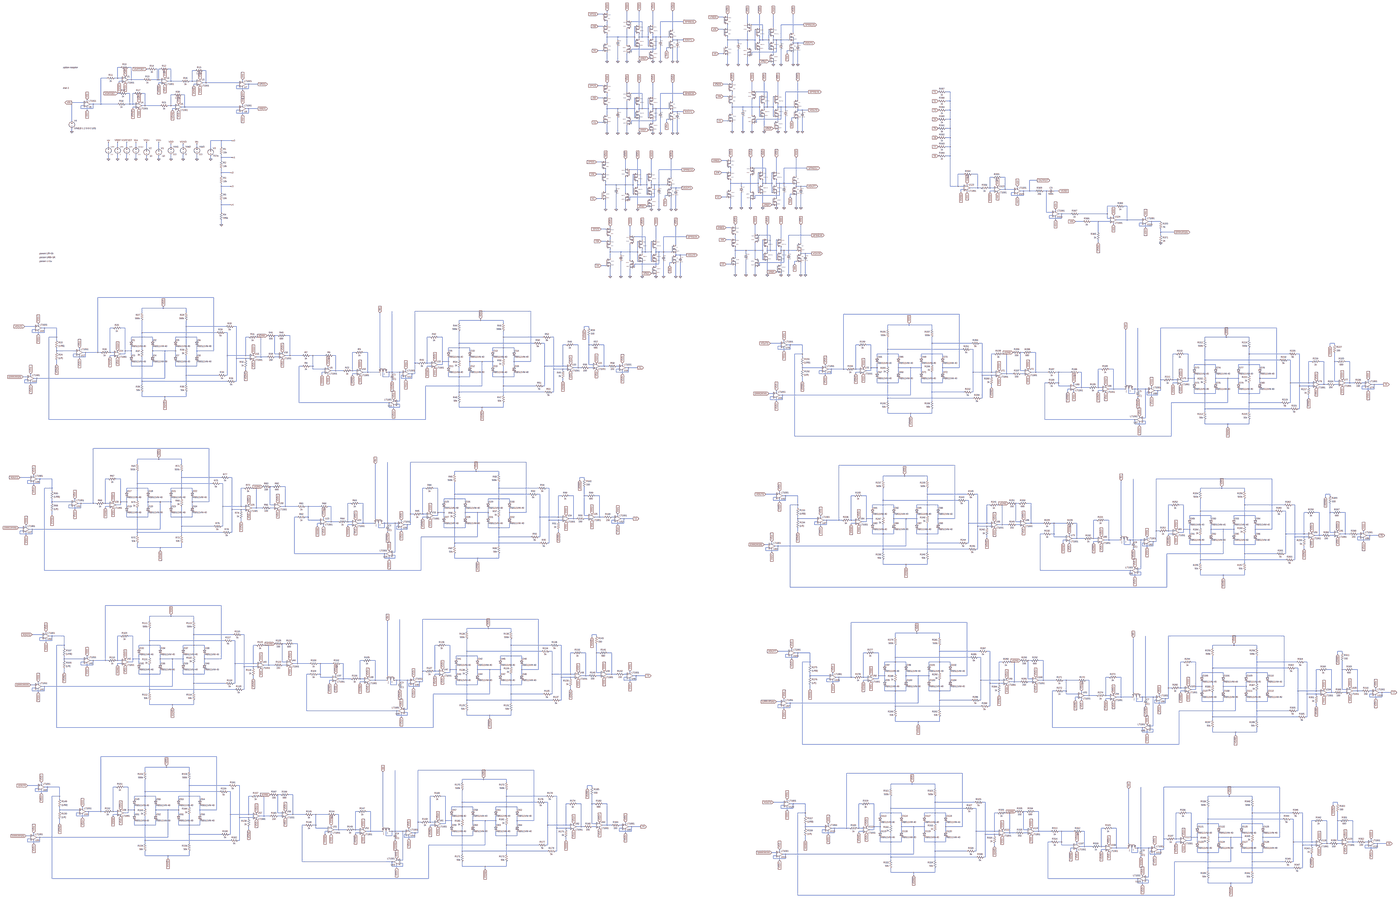
[diagram p0: schematic OZ_8_bounded_curves.asc, whole sheet]
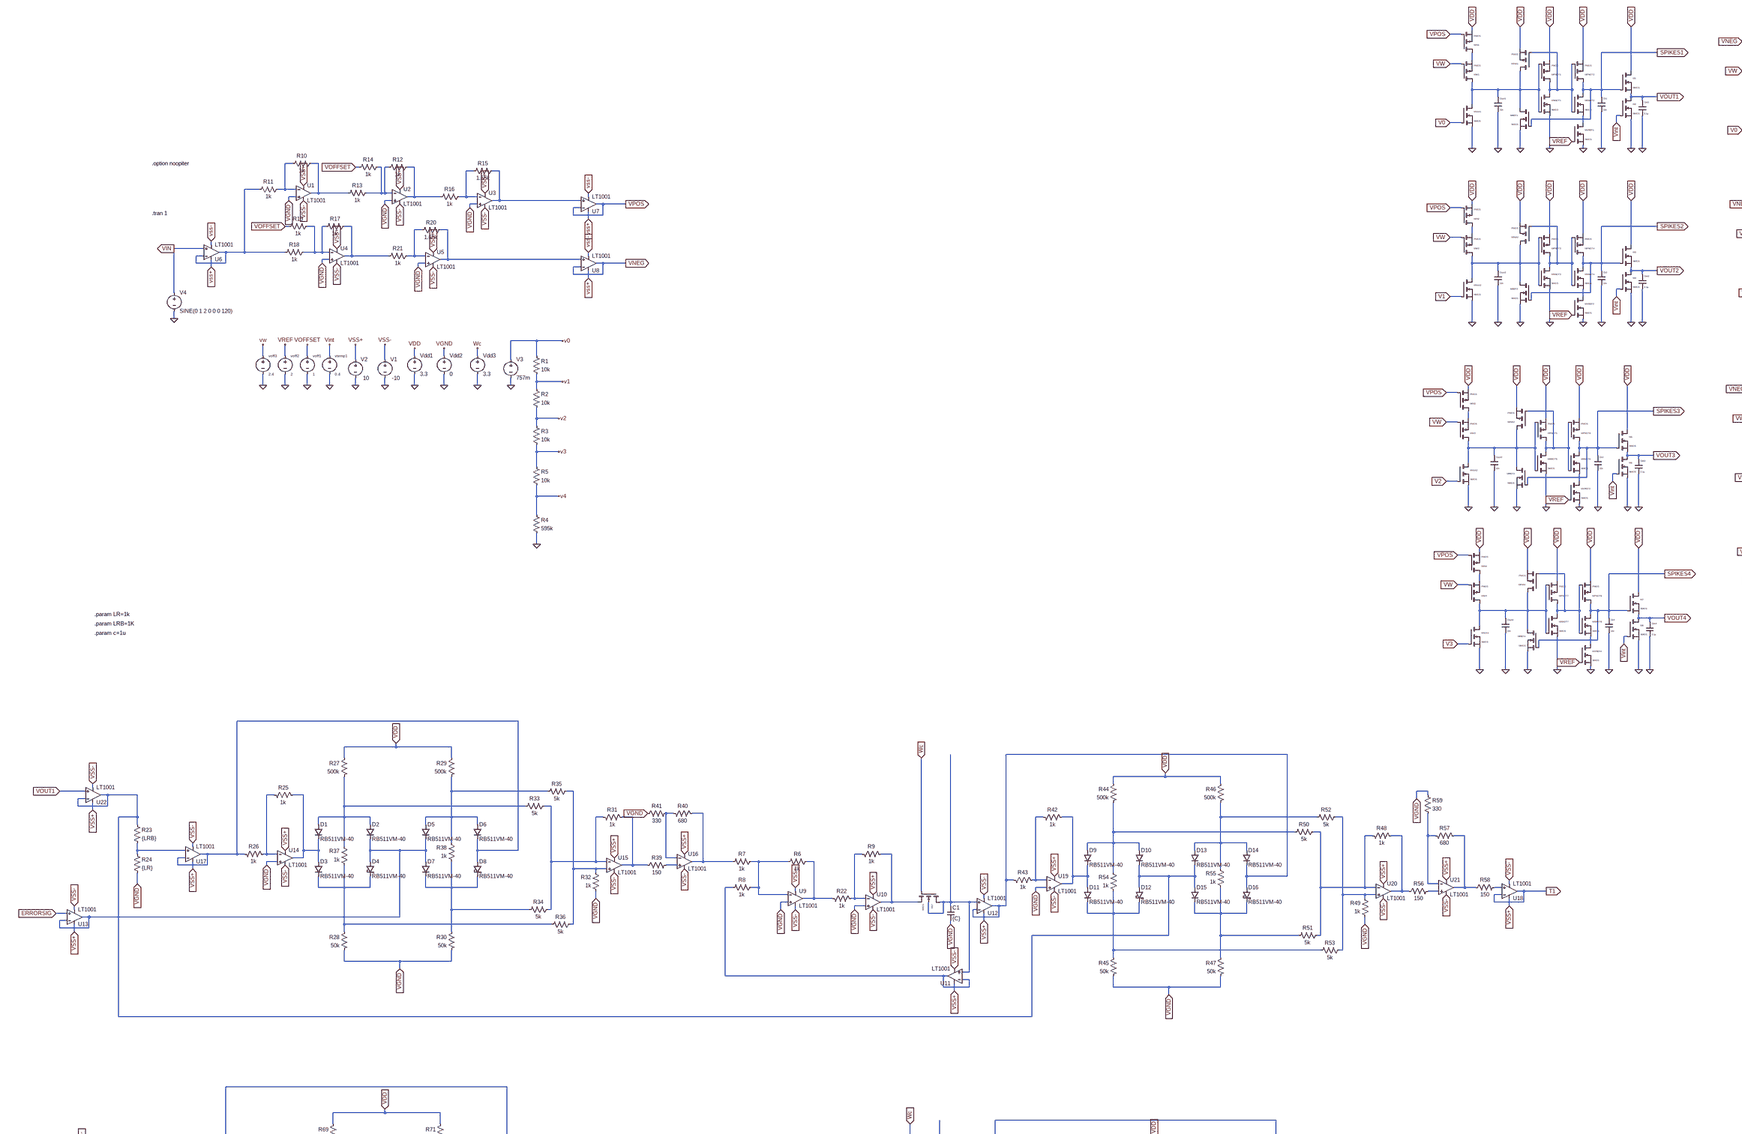
[diagram p1: schematic OZ_8_bounded_curves.asc, part, row 1 of 2, column 1 of 2]
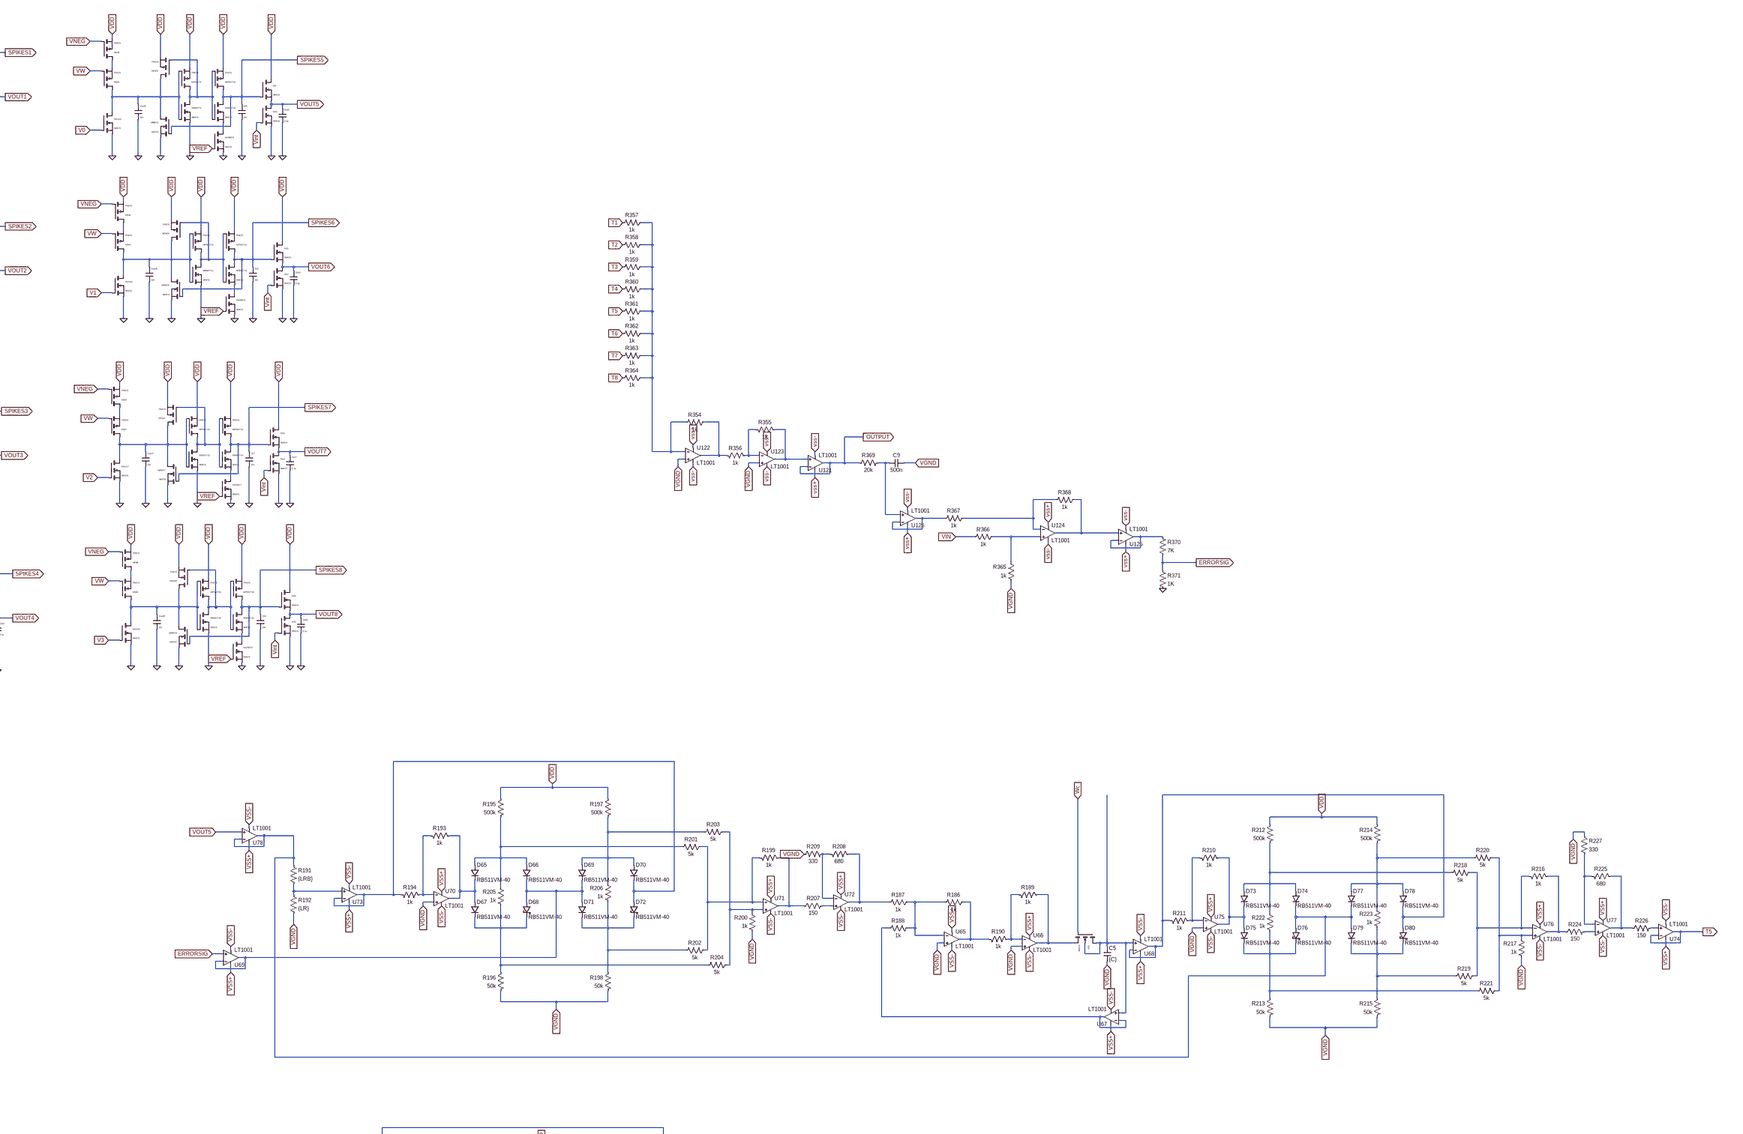
[diagram p2: schematic OZ_8_bounded_curves.asc, part, row 1 of 2, column 2 of 2]
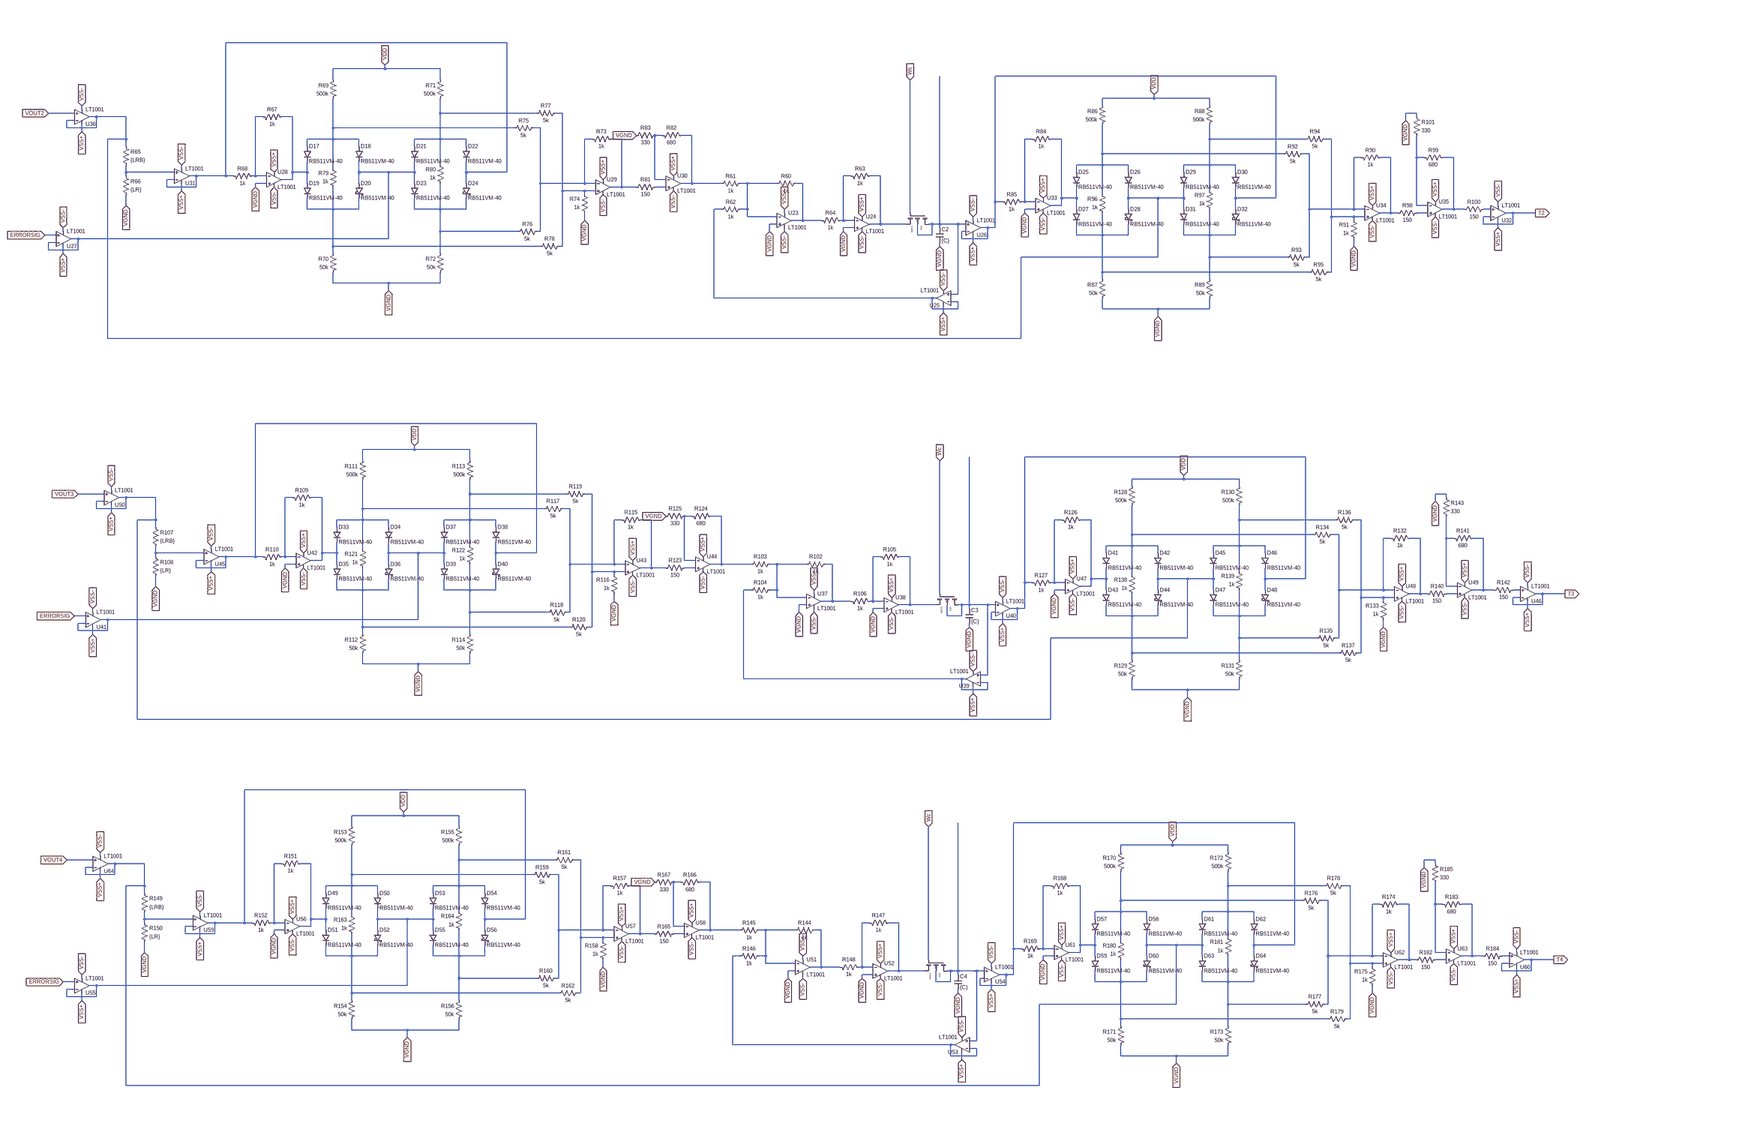
[diagram p3: schematic OZ_8_bounded_curves.asc, part, row 2 of 2, column 1 of 2]
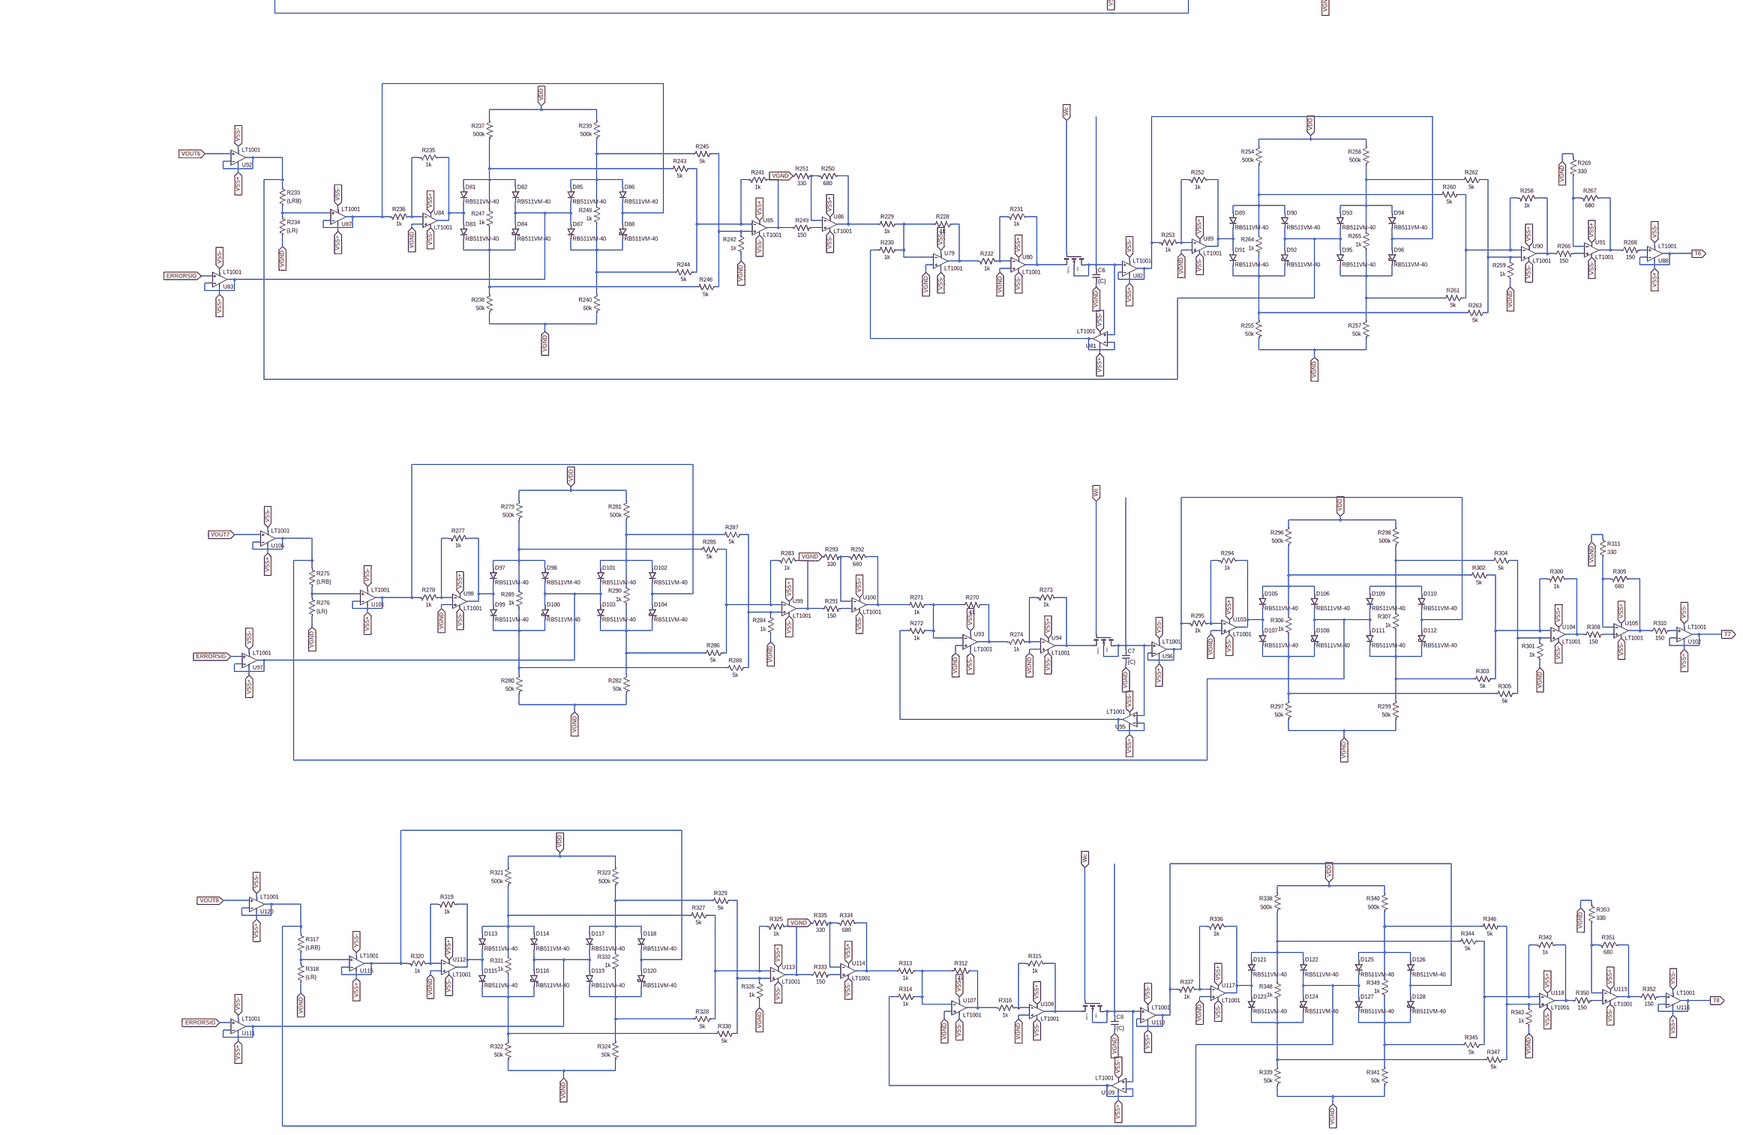
[diagram p4: schematic OZ_8_bounded_curves.asc, part, row 2 of 2, column 2 of 2]
* OZ_8_bounded_curves.asc
vtemp1 Vint 0 0.4
Vdd1 VDD 0 3.3
V1 VSS- 0 -10
V2 VSS+ 0 10
voff1 VOFFSET 0 1
voff2 VREF 0 2
voff3 vw 0 2.4
Vdd2 VGND 0 0
XU1 VGND N009 VSS+ VSS- N010 LT1001  ; pins In+ In- V+ V- OUT
R10 N010 N009 1k
R11 N009 N015 1k
XU2 VGND N011 VSS+ VSS- N012 LT1001  ; pins In+ In- V+ V- OUT
R12 N012 N011 1k
R13 N011 N010 1k
R14 N011 VOFFSET 1k
XU3 VGND N013 VSS+ VSS- N014 LT1001  ; pins In+ In- V+ V- OUT
R15 N014 N013 1.65k
R16 N013 N012 1k
XU4 VGND N018 VSS+ VSS- N019 LT1001  ; pins In+ In- V+ V- OUT
R17 N019 N018 1k
R18 N018 N015 1k
R19 N018 VOFFSET 1k
XU5 VGND N021 VSS+ VSS- N022 LT1001  ; pins In+ In- V+ V- OUT
R20 N022 N021 1.65k
R21 N021 N019 1k
XU6 VIN N015 VSS+ VSS- N015 LT1001  ; pins In+ In- V+ V- OUT
XU7 N014 VPOS VSS+ VSS- VPOS LT1001  ; pins In+ In- V+ V- OUT
XU8 N022 VNEG VSS+ VSS- VNEG LT1001  ; pins In+ In- V+ V- OUT
MW1 N005 vw N002 N002 PMOS
Csyn1 N005 0 10n V=4 Irms=162m Rser=0.395426 Lser=0 mfg="KEMET" pn="C0402C103K7PAC" type="X5R" IC=0
Ck1 SPIKES1 0 10n
MPNOT1 N001 N005 VDD VDD PMOS
MNNOT1 N001 N005 0 0 NMOS
MVREF1 N007 VREF 0 0 NMOS
MREF1 N005 SPIKES1 0 0 NMOS
MVLK1 N005 V0 0 0 NMOS
MINA1 N005 N001 VDD VDD PMOS
MIN1 N002 VPOS VDD VDD PMOS
MPNOT2 SPIKES1 N001 VDD VDD PMOS
MNNOT2 SPIKES1 N001 N007 N007 NMOS
M1 VDD SPIKES1 VOUT1 VOUT1 NMOS
M2 VOUT1 Vint 0 0 NMOS
Cint1 VOUT1 0 0.1µ
MW2 N026 vw N024 N024 PMOS
Csyn2 N026 0 10n V=4 Irms=162m Rser=0.395426 Lser=0 mfg="KEMET" pn="C0402C103K7PAC" type="X5R" IC=0
Ck2 SPIKES2 0 10n
MPNOT3 N020 N026 VDD VDD PMOS
MNNOT3 N020 N026 0 0 NMOS
MVREF2 N028 VREF 0 0 NMOS
MREF2 N026 SPIKES2 0 0 NMOS
MVLK2 N026 V1 0 0 NMOS
MINA2 N026 N020 VDD VDD PMOS
MIN2 N024 VPOS VDD VDD PMOS
MPNOT4 SPIKES2 N020 VDD VDD PMOS
MNNOT4 SPIKES2 N020 N028 N028 NMOS
M3 VDD SPIKES2 VOUT2 VOUT2 NMOS
M4 VOUT2 Vint 0 0 NMOS
Cint2 VOUT2 0 0.1µ
MW3 N037 vw N032 N032 PMOS
Csyn3 N037 0 10n V=4 Irms=162m Rser=0.395426 Lser=0 mfg="KEMET" pn="C0402C103K7PAC" type="X5R" IC=0
Ck3 SPIKES3 0 10n
MPNOT5 N030 N037 VDD VDD PMOS
MNNOT5 N030 N037 0 0 NMOS
MVREF3 N040 VREF 0 0 NMOS
MREF3 N037 SPIKES3 0 0 NMOS
MVLK3 N037 V2 0 0 NMOS
MINA3 N037 N030 VDD VDD PMOS
MIN3 N032 VPOS VDD VDD PMOS
MPNOT6 SPIKES3 N030 VDD VDD PMOS
MNNOT6 SPIKES3 N030 N040 N040 NMOS
M5 VDD SPIKES3 VOUT3 VOUT3 NMOS
M6 VOUT3 Vint 0 0 NMOS
Cint3 VOUT3 0 0.1µ
MW4 N051 vw N049 N049 PMOS
Csyn4 N051 0 10n V=4 Irms=162m Rser=0.395426 Lser=0 mfg="KEMET" pn="C0402C103K7PAC" type="X5R" IC=0
Ck4 SPIKES4 0 10n
MPNOT7 N047 N051 VDD VDD PMOS
MNNOT7 N047 N051 0 0 NMOS
MVREF4 N053 VREF 0 0 NMOS
MREF4 N051 SPIKES4 0 0 NMOS
MVLK4 N051 V3 0 0 NMOS
MINA4 N051 N047 VDD VDD PMOS
MIN4 N049 VPOS VDD VDD PMOS
MPNOT8 SPIKES4 N047 VDD VDD PMOS
MNNOT8 SPIKES4 N047 N053 N053 NMOS
M7 VDD SPIKES4 VOUT4 VOUT4 NMOS
M8 VOUT4 Vint 0 0 NMOS
Cint4 VOUT4 0 0.1µ
MW5 N006 vw N004 N004 PMOS
Csyn5 N006 0 10n V=4 Irms=162m Rser=0.395426 Lser=0 mfg="KEMET" pn="C0402C103K7PAC" type="X5R" IC=0
Ck5 SPIKES5 0 10n
MPNOT9 N003 N006 VDD VDD PMOS
MNNOT9 N003 N006 0 0 NMOS
MVREF5 N008 VREF 0 0 NMOS
MREF5 N006 SPIKES5 0 0 NMOS
MVLK5 N006 V0 0 0 NMOS
MINA5 N006 N003 VDD VDD PMOS
MIN5 N004 VNEG VDD VDD PMOS
MPNOT10 SPIKES5 N003 VDD VDD PMOS
MNNOT10 SPIKES5 N003 N008 N008 NMOS
M9 VDD SPIKES5 VOUT5 VOUT5 NMOS
M10 VOUT5 Vint 0 0 NMOS
Cint5 VOUT5 0 0.1µ
MW6 N025 vw N023 N023 PMOS
Csyn6 N025 0 10n V=4 Irms=162m Rser=0.395426 Lser=0 mfg="KEMET" pn="C0402C103K7PAC" type="X5R" IC=0
Ck6 SPIKES6 0 10n
MPNOT11 N016 N025 VDD VDD PMOS
MNNOT11 N016 N025 0 0 NMOS
MVREF6 N027 VREF 0 0 NMOS
MREF6 N025 SPIKES6 0 0 NMOS
MVLK6 N025 V1 0 0 NMOS
MINA6 N025 N016 VDD VDD PMOS
MIN6 N023 VNEG VDD VDD PMOS
MPNOT12 SPIKES6 N016 VDD VDD PMOS
MNNOT12 SPIKES6 N016 N027 N027 NMOS
M11 VDD SPIKES6 VOUT6 VOUT6 NMOS
M12 VOUT6 Vint 0 0 NMOS
Cint6 VOUT6 0 0.1µ
MW7 N036 vw N031 N031 PMOS
Csyn7 N036 0 10n V=4 Irms=162m Rser=0.395426 Lser=0 mfg="KEMET" pn="C0402C103K7PAC" type="X5R" IC=0
Ck7 SPIKES7 0 10n
MPNOT13 N029 N036 VDD VDD PMOS
MNNOT13 N029 N036 0 0 NMOS
MVREF7 N039 VREF 0 0 NMOS
MREF7 N036 SPIKES7 0 0 NMOS
MVLK7 N036 V2 0 0 NMOS
MINA7 N036 N029 VDD VDD PMOS
MIN7 N031 VNEG VDD VDD PMOS
MPNOT14 SPIKES7 N029 VDD VDD PMOS
MNNOT14 SPIKES7 N029 N039 N039 NMOS
M13 VDD SPIKES7 VOUT7 VOUT7 NMOS
M14 VOUT7 Vint 0 0 NMOS
Cint7 VOUT7 0 0.1µ
MW8 N050 vw N048 N048 PMOS
Csyn8 N050 0 10n V=4 Irms=162m Rser=0.395426 Lser=0 mfg="KEMET" pn="C0402C103K7PAC" type="X5R" IC=0
Ck8 SPIKES8 0 10n
MPNOT15 N046 N050 VDD VDD PMOS
MNNOT15 N046 N050 0 0 NMOS
MVREF8 N052 VREF 0 0 NMOS
MREF8 N050 SPIKES8 0 0 NMOS
MVLK8 N050 V3 0 0 NMOS
MINA8 N050 N046 VDD VDD PMOS
MIN8 N048 VNEG VDD VDD PMOS
MPNOT16 SPIKES8 N046 VDD VDD PMOS
MNNOT16 SPIKES8 N046 N052 N052 NMOS
M15 VDD SPIKES8 VOUT8 VOUT8 NMOS
M16 VOUT8 Vint 0 0 NMOS
Cint8 VOUT8 0 0.1µ
V3 V0 0 757m
R1 V0 V1 10k
R2 V1 V2 10k
R3 V2 V3 10k
R4 v4 0 595k
R5 V3 v4 10k
V4 VIN 0 SINE(0 1 2 0 0 0 120)
XU121 N035 OUTPUT VSS+ VSS- OUTPUT LT1001  ; pins In+ In- V+ V- OUT
XU122 VGND N017 VSS+ VSS- N033 LT1001  ; pins In+ In- V+ V- OUT
R354 N033 N017 1k
XU123 VGND N034 VSS+ VSS- N035 LT1001  ; pins In+ In- V+ V- OUT
R355 N034 N035 1k
R356 N033 N034 1k
R357 N017 T1 1k
R358 N017 T2 1k
R359 N017 T3 1k
R360 N017 T4 1k
R361 N017 T5 1k
R362 N017 T6 1k
R363 N017 T7 1k
R364 N017 T8 1k
M17 N112 Wc N087 N112 NMOS
C1 N112 VGND {C} IC=0
XU9 VGND N095 VSS+ VSS- N096 LT1001  ; pins In+ In- V+ V- OUT
R6 N096 N095 1k
R7 N095 N066 1k
R8 N095 N105 1k
XU10 VGND N086 VSS+ VSS- N087 LT1001  ; pins In+ In- V+ V- OUT
R9 N086 N087 1k
R22 N096 N086 1k
XU11 N112 N105 VSS+ VSS- N105 LT1001  ; pins In+ In- V+ V- OUT
XU12 N112 N055 VSS+ VSS- N055 LT1001  ; pins In+ In- V+ V- OUT
R23 N059 N084 {LRB}
R24 N084 VGND {LR}
XU13 ERRORSIG N085 VSS+ VSS- N085 LT1001  ; pins In+ In- V+ V- OUT
D1 N063 N061 RB511VM-40
XU14 VGND N060 VSS+ VSS- N061 LT1001  ; pins In+ In- V+ V- OUT
R25 N060 N061 1k
R26 N054 N060 1k
D2 N063 N085 RB511VM-40
D3 N061 N103 RB511VM-40
D4 N085 N103 RB511VM-40
R27 VDD N063 500k
R28 N103 VGND 50k
D5 N057 N085 RB511VM-40
D6 N057 N054 RB511VM-40
D7 N085 N104 RB511VM-40
D8 N054 N104 RB511VM-40
R29 VDD N057 500k
R30 N104 VGND 50k
XU15 N058 N064 VSS+ VSS- N067 LT1001  ; pins In+ In- V+ V- OUT
R31 N064 N067 1k
R32 VGND N058 1k
R33 N064 N063 5k
R34 N064 N104 5k
R35 N058 N057 5k
R36 N058 N103 5k
R37 N103 N063 1k
R38 N104 N057 1k
R39 N067 N097 150
XU16 N097 N065 VSS+ VSS- N066 LT1001  ; pins In+ In- V+ V- OUT
R40 N065 N066 680
R41 VGND N065 330
XU17 N084 N054 VSS+ VSS- N054 LT1001  ; pins In+ In- V+ V- OUT
XU18 N106 T1 VSS+ VSS- T1 LT1001  ; pins In+ In- V+ V- OUT
D9 N072 N069 RB511VM-40
XU19 VGND N068 VSS+ VSS- N069 LT1001  ; pins In+ In- V+ V- OUT
R42 N068 N069 1k
R43 N055 N068 1k
D10 N072 N059 RB511VM-40
D11 N069 N116 RB511VM-40
D12 N059 N116 RB511VM-40
R44 VDD N072 500k
R45 N116 VGND 50k
D13 N070 N059 RB511VM-40
D14 N070 N055 RB511VM-40
D15 N059 N117 RB511VM-40
D16 N055 N117 RB511VM-40
R46 VDD N070 500k
R47 N117 VGND 50k
XU20 N071 N073 VSS+ VSS- N076 LT1001  ; pins In+ In- V+ V- OUT
R48 N073 N076 1k
R49 VGND N071 1k
R50 N073 N072 5k
R51 N073 N117 5k
R52 N071 N070 5k
R53 N071 N116 5k
R54 N116 N072 1k
R55 N117 N070 1k
R56 N076 N107 150
XU21 N107 N077 VSS+ VSS- N078 LT1001  ; pins In+ In- V+ V- OUT
R57 N077 N078 680
R58 N078 N106 150
R59 VGND N077 330
XU22 VOUT1 N059 VSS+ VSS- N059 LT1001  ; pins In+ In- V+ V- OUT
M18 N184 Wc N159 N184 NMOS
C2 N184 VGND {C} IC=0
XU23 VGND N167 VSS+ VSS- N168 LT1001  ; pins In+ In- V+ V- OUT
R60 N168 N167 1k
R61 N167 N138 1k
R62 N167 N177 1k
XU24 VGND N158 VSS+ VSS- N159 LT1001  ; pins In+ In- V+ V- OUT
R63 N158 N159 1k
R64 N168 N158 1k
XU25 N184 N177 VSS+ VSS- N177 LT1001  ; pins In+ In- V+ V- OUT
XU26 N184 N127 VSS+ VSS- N127 LT1001  ; pins In+ In- V+ V- OUT
R65 N131 N156 {LRB}
R66 N156 VGND {LR}
XU27 ERRORSIG N157 VSS+ VSS- N157 LT1001  ; pins In+ In- V+ V- OUT
D17 N135 N133 RB511VM-40
XU28 VGND N132 VSS+ VSS- N133 LT1001  ; pins In+ In- V+ V- OUT
R67 N132 N133 1k
R68 N126 N132 1k
D18 N135 N157 RB511VM-40
D19 N133 N175 RB511VM-40
D20 N157 N175 RB511VM-40
R69 VDD N135 500k
R70 N175 VGND 50k
D21 N129 N157 RB511VM-40
D22 N129 N126 RB511VM-40
D23 N157 N176 RB511VM-40
D24 N126 N176 RB511VM-40
R71 VDD N129 500k
R72 N176 VGND 50k
XU29 N130 N136 VSS+ VSS- N139 LT1001  ; pins In+ In- V+ V- OUT
R73 N136 N139 1k
R74 VGND N130 1k
R75 N136 N135 5k
R76 N136 N176 5k
R77 N130 N129 5k
R78 N130 N175 5k
R79 N175 N135 1k
R80 N176 N129 1k
R81 N139 N169 150
XU30 N169 N137 VSS+ VSS- N138 LT1001  ; pins In+ In- V+ V- OUT
R82 N137 N138 680
R83 VGND N137 330
XU31 N156 N126 VSS+ VSS- N126 LT1001  ; pins In+ In- V+ V- OUT
XU32 N178 T2 VSS+ VSS- T2 LT1001  ; pins In+ In- V+ V- OUT
D25 N144 N141 RB511VM-40
XU33 VGND N140 VSS+ VSS- N141 LT1001  ; pins In+ In- V+ V- OUT
R84 N140 N141 1k
R85 N127 N140 1k
D26 N144 N131 RB511VM-40
D27 N141 N188 RB511VM-40
D28 N131 N188 RB511VM-40
R86 VDD N144 500k
R87 N188 VGND 50k
D29 N142 N131 RB511VM-40
D30 N142 N127 RB511VM-40
D31 N131 N189 RB511VM-40
D32 N127 N189 RB511VM-40
R88 VDD N142 500k
R89 N189 VGND 50k
XU34 N143 N145 VSS+ VSS- N148 LT1001  ; pins In+ In- V+ V- OUT
R90 N145 N148 1k
R91 VGND N143 1k
R92 N145 N144 5k
R93 N145 N189 5k
R94 N143 N142 5k
R95 N143 N188 5k
R96 N188 N144 1k
R97 N189 N142 1k
R98 N148 N179 150
XU35 N179 N149 VSS+ VSS- N150 LT1001  ; pins In+ In- V+ V- OUT
R99 N149 N150 680
R100 N150 N178 150
R101 VGND N149 330
XU36 VOUT2 N131 VSS+ VSS- N131 LT1001  ; pins In+ In- V+ V- OUT
M19 N256 Wc N231 N256 NMOS
C3 N256 VGND {C} IC=0
XU37 VGND N239 VSS+ VSS- N240 LT1001  ; pins In+ In- V+ V- OUT
R102 N240 N239 1k
R103 N239 N210 1k
R104 N239 N249 1k
XU38 VGND N230 VSS+ VSS- N231 LT1001  ; pins In+ In- V+ V- OUT
R105 N230 N231 1k
R106 N240 N230 1k
XU39 N256 N249 VSS+ VSS- N249 LT1001  ; pins In+ In- V+ V- OUT
XU40 N256 N199 VSS+ VSS- N199 LT1001  ; pins In+ In- V+ V- OUT
R107 N203 N228 {LRB}
R108 N228 VGND {LR}
XU41 ERRORSIG N229 VSS+ VSS- N229 LT1001  ; pins In+ In- V+ V- OUT
D33 N207 N205 RB511VM-40
XU42 VGND N204 VSS+ VSS- N205 LT1001  ; pins In+ In- V+ V- OUT
R109 N204 N205 1k
R110 N198 N204 1k
D34 N207 N229 RB511VM-40
D35 N205 N247 RB511VM-40
D36 N229 N247 RB511VM-40
R111 VDD N207 500k
R112 N247 VGND 50k
D37 N201 N229 RB511VM-40
D38 N201 N198 RB511VM-40
D39 N229 N248 RB511VM-40
D40 N198 N248 RB511VM-40
R113 VDD N201 500k
R114 N248 VGND 50k
XU43 N202 N208 VSS+ VSS- N211 LT1001  ; pins In+ In- V+ V- OUT
R115 N208 N211 1k
R116 VGND N202 1k
R117 N208 N207 5k
R118 N208 N248 5k
R119 N202 N201 5k
R120 N202 N247 5k
R121 N247 N207 1k
R122 N248 N201 1k
R123 N211 N241 150
XU44 N241 N209 VSS+ VSS- N210 LT1001  ; pins In+ In- V+ V- OUT
R124 N209 N210 680
R125 VGND N209 330
XU45 N228 N198 VSS+ VSS- N198 LT1001  ; pins In+ In- V+ V- OUT
XU46 N250 T3 VSS+ VSS- T3 LT1001  ; pins In+ In- V+ V- OUT
D41 N216 N213 RB511VM-40
XU47 VGND N212 VSS+ VSS- N213 LT1001  ; pins In+ In- V+ V- OUT
R126 N212 N213 1k
R127 N199 N212 1k
D42 N216 N203 RB511VM-40
D43 N213 N260 RB511VM-40
D44 N203 N260 RB511VM-40
R128 VDD N216 500k
R129 N260 VGND 50k
D45 N214 N203 RB511VM-40
D46 N214 N199 RB511VM-40
D47 N203 N261 RB511VM-40
D48 N199 N261 RB511VM-40
R130 VDD N214 500k
R131 N261 VGND 50k
XU48 N215 N217 VSS+ VSS- N220 LT1001  ; pins In+ In- V+ V- OUT
R132 N217 N220 1k
R133 VGND N215 1k
R134 N217 N216 5k
R135 N217 N261 5k
R136 N215 N214 5k
R137 N215 N260 5k
R138 N260 N216 1k
R139 N261 N214 1k
R140 N220 N251 150
XU49 N251 N221 VSS+ VSS- N222 LT1001  ; pins In+ In- V+ V- OUT
R141 N221 N222 680
R142 N222 N250 150
R143 VGND N221 330
XU50 VOUT3 N203 VSS+ VSS- N203 LT1001  ; pins In+ In- V+ V- OUT
M20 N328 Wc N303 N328 NMOS
C4 N328 VGND {C} IC=0
XU51 VGND N311 VSS+ VSS- N312 LT1001  ; pins In+ In- V+ V- OUT
R144 N312 N311 1k
R145 N311 N282 1k
R146 N311 N321 1k
XU52 VGND N302 VSS+ VSS- N303 LT1001  ; pins In+ In- V+ V- OUT
R147 N302 N303 1k
R148 N312 N302 1k
XU53 N328 N321 VSS+ VSS- N321 LT1001  ; pins In+ In- V+ V- OUT
XU54 N328 N271 VSS+ VSS- N271 LT1001  ; pins In+ In- V+ V- OUT
R149 N275 N300 {LRB}
R150 N300 VGND {LR}
XU55 ERRORSIG N301 VSS+ VSS- N301 LT1001  ; pins In+ In- V+ V- OUT
D49 N279 N277 RB511VM-40
XU56 VGND N276 VSS+ VSS- N277 LT1001  ; pins In+ In- V+ V- OUT
R151 N276 N277 1k
R152 N270 N276 1k
D50 N279 N301 RB511VM-40
D51 N277 N319 RB511VM-40
D52 N301 N319 RB511VM-40
R153 VDD N279 500k
R154 N319 VGND 50k
D53 N273 N301 RB511VM-40
D54 N273 N270 RB511VM-40
D55 N301 N320 RB511VM-40
D56 N270 N320 RB511VM-40
R155 VDD N273 500k
R156 N320 VGND 50k
XU57 N274 N280 VSS+ VSS- N283 LT1001  ; pins In+ In- V+ V- OUT
R157 N280 N283 1k
R158 VGND N274 1k
R159 N280 N279 5k
R160 N280 N320 5k
R161 N274 N273 5k
R162 N274 N319 5k
R163 N319 N279 1k
R164 N320 N273 1k
R165 N283 N313 150
XU58 N313 N281 VSS+ VSS- N282 LT1001  ; pins In+ In- V+ V- OUT
R166 N281 N282 680
R167 VGND N281 330
XU59 N300 N270 VSS+ VSS- N270 LT1001  ; pins In+ In- V+ V- OUT
XU60 N322 T4 VSS+ VSS- T4 LT1001  ; pins In+ In- V+ V- OUT
D57 N288 N285 RB511VM-40
XU61 VGND N284 VSS+ VSS- N285 LT1001  ; pins In+ In- V+ V- OUT
R168 N284 N285 1k
R169 N271 N284 1k
D58 N288 N275 RB511VM-40
D59 N285 N332 RB511VM-40
D60 N275 N332 RB511VM-40
R170 VDD N288 500k
R171 N332 VGND 50k
D61 N286 N275 RB511VM-40
D62 N286 N271 RB511VM-40
D63 N275 N333 RB511VM-40
D64 N271 N333 RB511VM-40
R172 VDD N286 500k
R173 N333 VGND 50k
XU62 N287 N289 VSS+ VSS- N292 LT1001  ; pins In+ In- V+ V- OUT
R174 N289 N292 1k
R175 VGND N287 1k
R176 N289 N288 5k
R177 N289 N333 5k
R178 N287 N286 5k
R179 N287 N332 5k
R180 N332 N288 1k
R181 N333 N286 1k
R182 N292 N323 150
XU63 N323 N293 VSS+ VSS- N294 LT1001  ; pins In+ In- V+ V- OUT
R183 N293 N294 680
R184 N294 N322 150
R185 VGND N293 330
XU64 VOUT4 N275 VSS+ VSS- N275 LT1001  ; pins In+ In- V+ V- OUT
M21 N123 Wc N111 N123 NMOS
C5 N123 VGND {C} IC=0
XU65 VGND N113 VSS+ VSS- N114 LT1001  ; pins In+ In- V+ V- OUT
R186 N114 N113 1k
R187 N113 N089 1k
R188 N113 N120 1k
XU66 VGND N110 VSS+ VSS- N111 LT1001  ; pins In+ In- V+ V- OUT
R189 N110 N111 1k
R190 N114 N110 1k
XU67 N123 N120 VSS+ VSS- N120 LT1001  ; pins In+ In- V+ V- OUT
XU68 N123 N062 VSS+ VSS- N062 LT1001  ; pins In+ In- V+ V- OUT
R191 N079 N108 {LRB}
R192 N108 VGND {LR}
XU69 ERRORSIG N109 VSS+ VSS- N109 LT1001  ; pins In+ In- V+ V- OUT
D65 N082 N081 RB511VM-40
XU70 VGND N080 VSS+ VSS- N081 LT1001  ; pins In+ In- V+ V- OUT
R193 N080 N081 1k
R194 N056 N080 1k
D66 N082 N109 RB511VM-40
D67 N081 N118 RB511VM-40
D68 N109 N118 RB511VM-40
R195 VDD N082 500k
R196 N118 VGND 50k
D69 N074 N109 RB511VM-40
D70 N074 N056 RB511VM-40
D71 N109 N119 RB511VM-40
D72 N056 N119 RB511VM-40
R197 VDD N074 500k
R198 N119 VGND 50k
XU71 N075 N083 VSS+ VSS- N090 LT1001  ; pins In+ In- V+ V- OUT
R199 N083 N090 1k
R200 VGND N075 1k
R201 N083 N082 5k
R202 N083 N119 5k
R203 N075 N074 5k
R204 N075 N118 5k
R205 N118 N082 1k
R206 N119 N074 1k
R207 N090 N115 150
XU72 N115 N088 VSS+ VSS- N089 LT1001  ; pins In+ In- V+ V- OUT
R208 N088 N089 680
R209 VGND N088 330
XU73 N108 N056 VSS+ VSS- N056 LT1001  ; pins In+ In- V+ V- OUT
XU74 N121 T5 VSS+ VSS- T5 LT1001  ; pins In+ In- V+ V- OUT
D73 N098 N092 RB511VM-40
XU75 VGND N091 VSS+ VSS- N092 LT1001  ; pins In+ In- V+ V- OUT
R210 N091 N092 1k
R211 N062 N091 1k
D74 N098 N079 RB511VM-40
D75 N092 N124 RB511VM-40
D76 N079 N124 RB511VM-40
R212 VDD N098 500k
R213 N124 VGND 50k
D77 N093 N079 RB511VM-40
D78 N093 N062 RB511VM-40
D79 N079 N125 RB511VM-40
D80 N062 N125 RB511VM-40
R214 VDD N093 500k
R215 N125 VGND 50k
XU76 N094 N099 VSS+ VSS- N100 LT1001  ; pins In+ In- V+ V- OUT
R216 N099 N100 1k
R217 VGND N094 1k
R218 N099 N098 5k
R219 N099 N125 5k
R220 N094 N093 5k
R221 N094 N124 5k
R222 N124 N098 1k
R223 N125 N093 1k
R224 N100 N122 150
XU77 N122 N101 VSS+ VSS- N102 LT1001  ; pins In+ In- V+ V- OUT
R225 N101 N102 680
R226 N102 N121 150
R227 VGND N101 330
XU78 VOUT5 N079 VSS+ VSS- N079 LT1001  ; pins In+ In- V+ V- OUT
M22 N195 Wc N183 N195 NMOS
C6 N195 VGND {C} IC=0
XU79 VGND N185 VSS+ VSS- N186 LT1001  ; pins In+ In- V+ V- OUT
R228 N186 N185 1k
R229 N185 N161 1k
R230 N185 N192 1k
XU80 VGND N182 VSS+ VSS- N183 LT1001  ; pins In+ In- V+ V- OUT
R231 N182 N183 1k
R232 N186 N182 1k
XU81 N195 N192 VSS+ VSS- N192 LT1001  ; pins In+ In- V+ V- OUT
XU82 N195 N134 VSS+ VSS- N134 LT1001  ; pins In+ In- V+ V- OUT
R233 N151 N180 {LRB}
R234 N180 VGND {LR}
XU83 ERRORSIG N181 VSS+ VSS- N181 LT1001  ; pins In+ In- V+ V- OUT
D81 N154 N153 RB511VM-40
XU84 VGND N152 VSS+ VSS- N153 LT1001  ; pins In+ In- V+ V- OUT
R235 N152 N153 1k
R236 N128 N152 1k
D82 N154 N181 RB511VM-40
D83 N153 N190 RB511VM-40
D84 N181 N190 RB511VM-40
R237 VDD N154 500k
R238 N190 VGND 50k
D85 N146 N181 RB511VM-40
D86 N146 N128 RB511VM-40
D87 N181 N191 RB511VM-40
D88 N128 N191 RB511VM-40
R239 VDD N146 500k
R240 N191 VGND 50k
XU85 N147 N155 VSS+ VSS- N162 LT1001  ; pins In+ In- V+ V- OUT
R241 N155 N162 1k
R242 VGND N147 1k
R243 N155 N154 5k
R244 N155 N191 5k
R245 N147 N146 5k
R246 N147 N190 5k
R247 N190 N154 1k
R248 N191 N146 1k
R249 N162 N187 150
XU86 N187 N160 VSS+ VSS- N161 LT1001  ; pins In+ In- V+ V- OUT
R250 N160 N161 680
R251 VGND N160 330
XU87 N180 N128 VSS+ VSS- N128 LT1001  ; pins In+ In- V+ V- OUT
XU88 N193 T6 VSS+ VSS- T6 LT1001  ; pins In+ In- V+ V- OUT
D89 N170 N164 RB511VM-40
XU89 VGND N163 VSS+ VSS- N164 LT1001  ; pins In+ In- V+ V- OUT
R252 N163 N164 1k
R253 N134 N163 1k
D90 N170 N151 RB511VM-40
D91 N164 N196 RB511VM-40
D92 N151 N196 RB511VM-40
R254 VDD N170 500k
R255 N196 VGND 50k
D93 N165 N151 RB511VM-40
D94 N165 N134 RB511VM-40
D95 N151 N197 RB511VM-40
D96 N134 N197 RB511VM-40
R256 VDD N165 500k
R257 N197 VGND 50k
XU90 N166 N171 VSS+ VSS- N172 LT1001  ; pins In+ In- V+ V- OUT
R258 N171 N172 1k
R259 VGND N166 1k
R260 N171 N170 5k
R261 N171 N197 5k
R262 N166 N165 5k
R263 N166 N196 5k
R264 N196 N170 1k
R265 N197 N165 1k
R266 N172 N194 150
XU91 N194 N173 VSS+ VSS- N174 LT1001  ; pins In+ In- V+ V- OUT
R267 N173 N174 680
R268 N174 N193 150
R269 VGND N173 330
XU92 VOUT6 N151 VSS+ VSS- N151 LT1001  ; pins In+ In- V+ V- OUT
M23 N267 Wc N255 N267 NMOS
C7 N267 VGND {C} IC=0
XU93 VGND N257 VSS+ VSS- N258 LT1001  ; pins In+ In- V+ V- OUT
R270 N258 N257 1k
R271 N257 N233 1k
R272 N257 N264 1k
XU94 VGND N254 VSS+ VSS- N255 LT1001  ; pins In+ In- V+ V- OUT
R273 N254 N255 1k
R274 N258 N254 1k
XU95 N267 N264 VSS+ VSS- N264 LT1001  ; pins In+ In- V+ V- OUT
XU96 N267 N206 VSS+ VSS- N206 LT1001  ; pins In+ In- V+ V- OUT
R275 N223 N252 {LRB}
R276 N252 VGND {LR}
XU97 ERRORSIG N253 VSS+ VSS- N253 LT1001  ; pins In+ In- V+ V- OUT
D97 N226 N225 RB511VM-40
XU98 VGND N224 VSS+ VSS- N225 LT1001  ; pins In+ In- V+ V- OUT
R277 N224 N225 1k
R278 N200 N224 1k
D98 N226 N253 RB511VM-40
D99 N225 N262 RB511VM-40
D100 N253 N262 RB511VM-40
R279 VDD N226 500k
R280 N262 VGND 50k
D101 N218 N253 RB511VM-40
D102 N218 N200 RB511VM-40
D103 N253 N263 RB511VM-40
D104 N200 N263 RB511VM-40
R281 VDD N218 500k
R282 N263 VGND 50k
XU99 N219 N227 VSS+ VSS- N234 LT1001  ; pins In+ In- V+ V- OUT
R283 N227 N234 1k
R284 VGND N219 1k
R285 N227 N226 5k
R286 N227 N263 5k
R287 N219 N218 5k
R288 N219 N262 5k
R289 N262 N226 1k
R290 N263 N218 1k
R291 N234 N259 150
XU100 N259 N232 VSS+ VSS- N233 LT1001  ; pins In+ In- V+ V- OUT
R292 N232 N233 680
R293 VGND N232 330
XU101 N252 N200 VSS+ VSS- N200 LT1001  ; pins In+ In- V+ V- OUT
XU102 N265 T7 VSS+ VSS- T7 LT1001  ; pins In+ In- V+ V- OUT
D105 N242 N236 RB511VM-40
XU103 VGND N235 VSS+ VSS- N236 LT1001  ; pins In+ In- V+ V- OUT
R294 N235 N236 1k
R295 N206 N235 1k
D106 N242 N223 RB511VM-40
D107 N236 N268 RB511VM-40
D108 N223 N268 RB511VM-40
R296 VDD N242 500k
R297 N268 VGND 50k
D109 N237 N223 RB511VM-40
D110 N237 N206 RB511VM-40
D111 N223 N269 RB511VM-40
D112 N206 N269 RB511VM-40
R298 VDD N237 500k
R299 N269 VGND 50k
XU104 N238 N243 VSS+ VSS- N244 LT1001  ; pins In+ In- V+ V- OUT
R300 N243 N244 1k
R301 VGND N238 1k
R302 N243 N242 5k
R303 N243 N269 5k
R304 N238 N237 5k
R305 N238 N268 5k
R306 N268 N242 1k
R307 N269 N237 1k
R308 N244 N266 150
XU105 N266 N245 VSS+ VSS- N246 LT1001  ; pins In+ In- V+ V- OUT
R309 N245 N246 680
R310 N246 N265 150
R311 VGND N245 330
XU106 VOUT7 N223 VSS+ VSS- N223 LT1001  ; pins In+ In- V+ V- OUT
M24 N339 Wc N327 N339 NMOS
C8 N339 VGND {C} IC=0
XU107 VGND N329 VSS+ VSS- N330 LT1001  ; pins In+ In- V+ V- OUT
R312 N330 N329 1k
R313 N329 N305 1k
R314 N329 N336 1k
XU108 VGND N326 VSS+ VSS- N327 LT1001  ; pins In+ In- V+ V- OUT
R315 N326 N327 1k
R316 N330 N326 1k
XU109 N339 N336 VSS+ VSS- N336 LT1001  ; pins In+ In- V+ V- OUT
XU110 N339 N278 VSS+ VSS- N278 LT1001  ; pins In+ In- V+ V- OUT
R317 N295 N324 {LRB}
R318 N324 VGND {LR}
XU111 ERRORSIG N325 VSS+ VSS- N325 LT1001  ; pins In+ In- V+ V- OUT
D113 N298 N297 RB511VM-40
XU112 VGND N296 VSS+ VSS- N297 LT1001  ; pins In+ In- V+ V- OUT
R319 N296 N297 1k
R320 N272 N296 1k
D114 N298 N325 RB511VM-40
D115 N297 N334 RB511VM-40
D116 N325 N334 RB511VM-40
R321 VDD N298 500k
R322 N334 VGND 50k
D117 N290 N325 RB511VM-40
D118 N290 N272 RB511VM-40
D119 N325 N335 RB511VM-40
D120 N272 N335 RB511VM-40
R323 VDD N290 500k
R324 N335 VGND 50k
XU113 N291 N299 VSS+ VSS- N306 LT1001  ; pins In+ In- V+ V- OUT
R325 N299 N306 1k
R326 VGND N291 1k
R327 N299 N298 5k
R328 N299 N335 5k
R329 N291 N290 5k
R330 N291 N334 5k
R331 N334 N298 1k
R332 N335 N290 1k
R333 N306 N331 150
XU114 N331 N304 VSS+ VSS- N305 LT1001  ; pins In+ In- V+ V- OUT
R334 N304 N305 680
R335 VGND N304 330
XU115 N324 N272 VSS+ VSS- N272 LT1001  ; pins In+ In- V+ V- OUT
XU116 N337 T8 VSS+ VSS- T8 LT1001  ; pins In+ In- V+ V- OUT
D121 N314 N308 RB511VM-40
XU117 VGND N307 VSS+ VSS- N308 LT1001  ; pins In+ In- V+ V- OUT
R336 N307 N308 1k
R337 N278 N307 1k
D122 N314 N295 RB511VM-40
D123 N308 N340 RB511VM-40
D124 N295 N340 RB511VM-40
R338 VDD N314 500k
R339 N340 VGND 50k
D125 N309 N295 RB511VM-40
D126 N309 N278 RB511VM-40
D127 N295 N341 RB511VM-40
D128 N278 N341 RB511VM-40
R340 VDD N309 500k
R341 N341 VGND 50k
XU118 N310 N315 VSS+ VSS- N316 LT1001  ; pins In+ In- V+ V- OUT
R342 N315 N316 1k
R343 VGND N310 1k
R344 N315 N314 5k
R345 N315 N341 5k
R346 N310 N309 5k
R347 N310 N340 5k
R348 N340 N314 1k
R349 N341 N309 1k
R350 N316 N338 150
XU119 N338 N317 VSS+ VSS- N318 LT1001  ; pins In+ In- V+ V- OUT
R351 N317 N318 680
R352 N318 N337 150
R353 VGND N317 330
XU120 VOUT8 N295 VSS+ VSS- N295 LT1001  ; pins In+ In- V+ V- OUT
XU124 N044 N041 VSS+ VSS- N042 LT1001  ; pins In+ In- V+ V- OUT
R365 VGND N044 1k
R366 N044 VIN 1k
R367 N041 N043 1k
R368 N042 N041 1k
XU125 N042 N045 VSS+ VSS- N045 LT1001  ; pins In+ In- V+ V- OUT
R369 OUTPUT N038 20k
C9 N038 VGND 500n
XU126 N038 N043 VSS+ VSS- N043 LT1001  ; pins In+ In- V+ V- OUT
R370 N045 ERRORSIG 7K
R371 ERRORSIG 0 1K
Vdd3 Wc 0 3.3
.model D D
.lib standard.dio
.model NMOS NMOS
.model PMOS PMOS
.lib standard.mos
.tran 1
.option noopiter
.param LR=1k
.param LRB=1K
.param c=1u
.lib LTC.lib
.backanno
.end